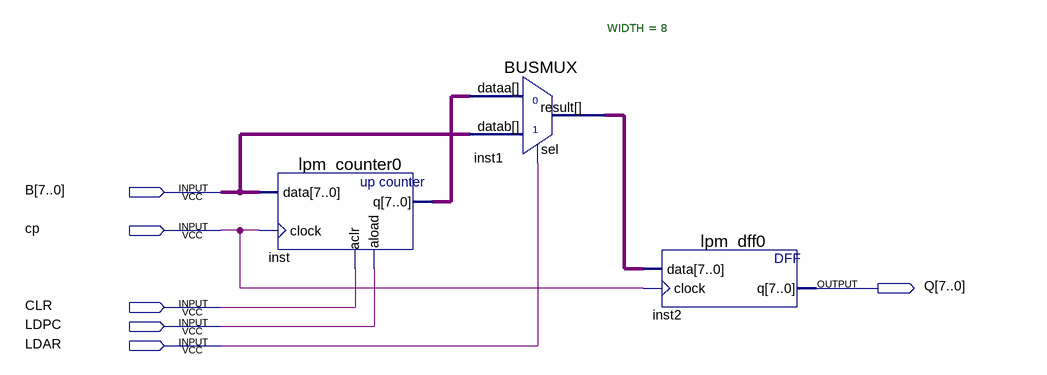
[diagram p0: schematic sheet]
// Quartus schematic lab4.bdf as structural Verilog: 3 symbols, 6 pins
module lab4 (
  input  [7:0] B,
  input  cp,
  input  CLR,
  input  LDPC,
  input  LDAR,
  output [7:0] Q
);

  wire [7:0] inst1_result, inst_q;

  lpm_counter0 inst (.data(B), .clock(cp), .aclr(CLR), .aload(LDPC), .q(inst_q));
  BUSMUX #(.WIDTH(8)) inst1 (.datab(B), .sel(LDAR), .dataa(inst_q), .result(inst1_result));
  lpm_dff0 inst2 (.data(inst1_result), .clock(cp), .q(Q));
endmodule
